# EAGLE schematic power (EAGLE 8.3.1)
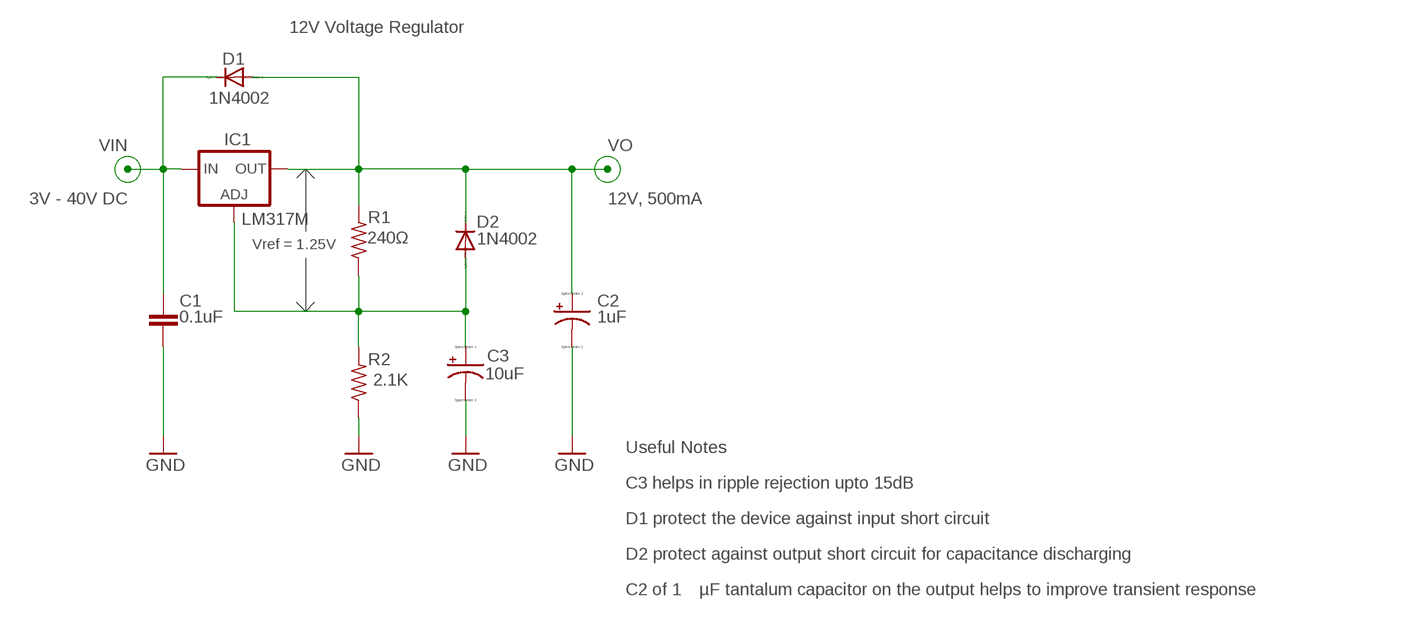
[diagram p0: schematic, sheet 1]

## Parts
C1  0.1uF  C-EU075-052X106  [C075-052X106]
C2  1uF  CPOL-US085CS-1AR  [085CS_1AR]
C3  10uF  CPOL-US085CS-1AR  [085CS_1AR]
D1  1N4002  1N4004  [DO41-10]
D2  1N4002  1N4004  [DO41-10]
IC1  LM317MBSTT3  [SOT223]
R1  240Ω  R-US_M0805  [M0805]
R2  2.1K  R-US_M0805  [M0805]

## Nets
GND: C1.2 C2.- C3.- R2.1
N$1: C3.+ D2.A IC1.1(ADJ) R1.1 R2.2
VIN: C1.1 D1.C IC1.3(IN)
VO: C2.+ D1.A D2.C IC1.4(OUT) R1.2

## Notes on the sheet
- 12V Voltage Regulator
- 3V - 40V DC | 12V, 500mA
- Vref = 1.25V
- Useful Notes
- C3 helps in ripple rejection upto 15dB
- D1 protect the device against input short circuit
- D2 protect against output short circuit for capacitance discharging
- C2 of 1 �µF tantalum capacitor on the output helps to improve transient response

## Library data of the parts
C1 = rcl:C-EU: CAPACITOR, European symbol
C2 C3 = resistor:CPOL-US: POLARIZED CAPACITOR, American symbol
D1 D2 = diode:1N4004: DIODE general purpose rectifier, 1 A
IC1 = v-reg:LM317?*: 500 mA Adjustable Output Positive Voltage Regulator Source: http://www.onsemi.co.jp .. LM317M-D.PDF; PARTNUMBER: LM317M
R1 R2 = resistor:R-US_: RESISTOR, American symbol